# Altium schematic sheet SCH_WINGLET_IO.SchDoc: Winglet Board I/O
size B; DrawnBy: HCAdam; Organization: Aerospace Village; DocumentNumber: WINGLET; Revision: A; SheetNumber: 9; SheetTotal: 10
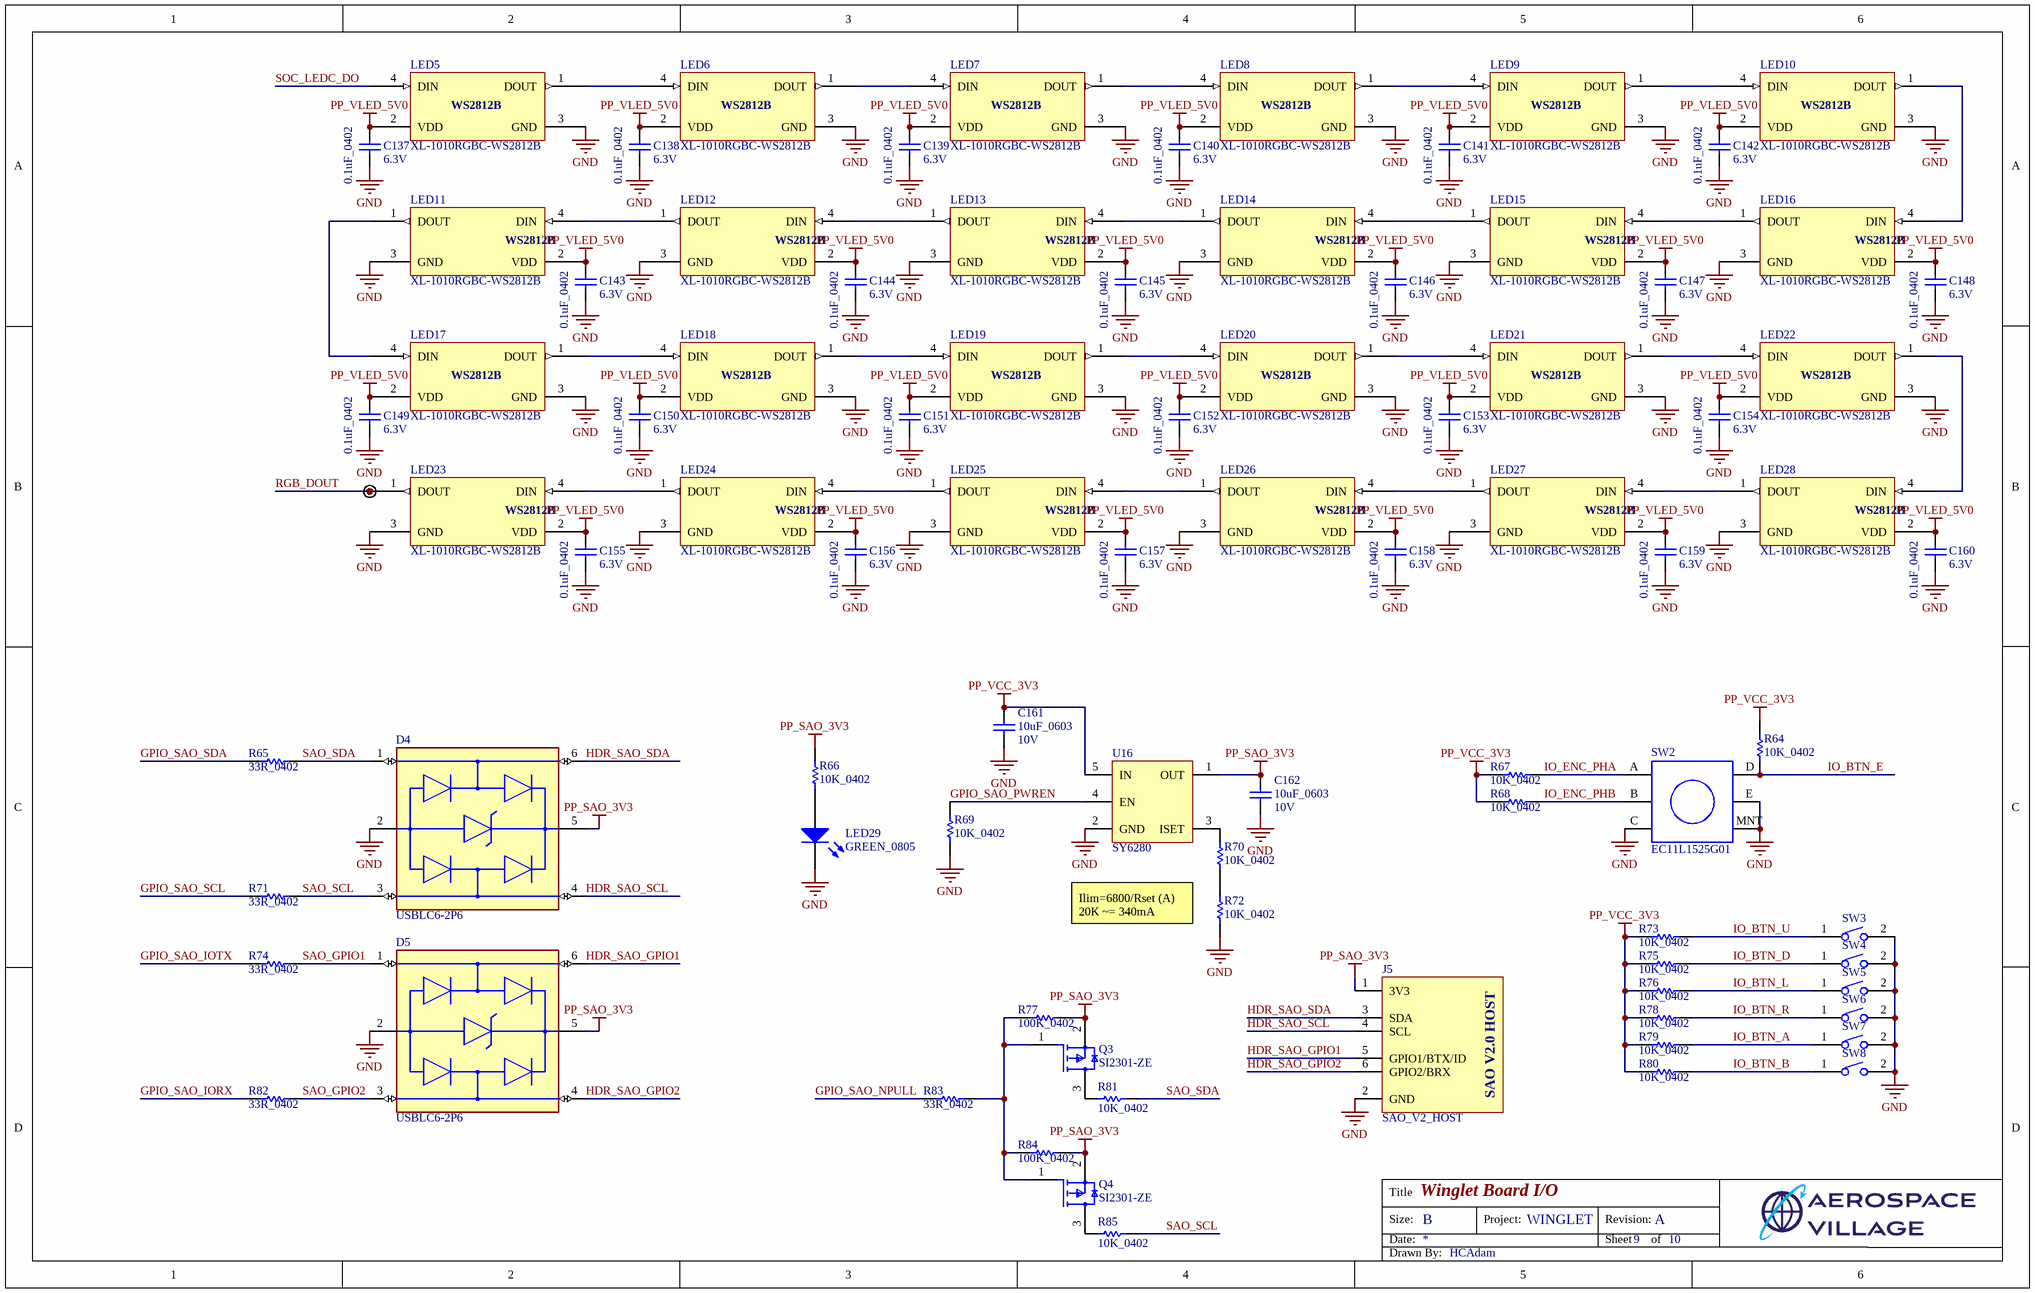
[diagram p0: SCH_WINGLET_IO.SchDoc]

## Parts
C137  0.1uF_0402  Voltage Rating: 6.3V  [CAPC1005X56X25NL10T15]
C138  0.1uF_0402  Voltage Rating: 6.3V  [CAPC1005X56X25NL10T15]
C139  0.1uF_0402  Voltage Rating: 6.3V  [CAPC1005X56X25NL10T15]
C140  0.1uF_0402  Voltage Rating: 6.3V  [CAPC1005X56X25NL10T15]
C141  0.1uF_0402  Voltage Rating: 6.3V  [CAPC1005X56X25NL10T15]
C142  0.1uF_0402  Voltage Rating: 6.3V  [CAPC1005X56X25NL10T15]
C143  0.1uF_0402  Voltage Rating: 6.3V  [CAPC1005X56X25NL10T15]
C144  0.1uF_0402  Voltage Rating: 6.3V  [CAPC1005X56X25NL10T15]
C145  0.1uF_0402  Voltage Rating: 6.3V  [CAPC1005X56X25NL10T15]
C146  0.1uF_0402  Voltage Rating: 6.3V  [CAPC1005X56X25NL10T15]
C147  0.1uF_0402  Voltage Rating: 6.3V  [CAPC1005X56X25NL10T15]
C148  0.1uF_0402  Voltage Rating: 6.3V  [CAPC1005X56X25NL10T15]
C149  0.1uF_0402  Voltage Rating: 6.3V  [CAPC1005X56X25NL10T15]
C150  0.1uF_0402  Voltage Rating: 6.3V  [CAPC1005X56X25NL10T15]
C151  0.1uF_0402  Voltage Rating: 6.3V  [CAPC1005X56X25NL10T15]
C152  0.1uF_0402  Voltage Rating: 6.3V  [CAPC1005X56X25NL10T15]
C153  0.1uF_0402  Voltage Rating: 6.3V  [CAPC1005X56X25NL10T15]
C154  0.1uF_0402  Voltage Rating: 6.3V  [CAPC1005X56X25NL10T15]
C155  0.1uF_0402  Voltage Rating: 6.3V  [CAPC1005X56X25NL10T15]
C156  0.1uF_0402  Voltage Rating: 6.3V  [CAPC1005X56X25NL10T15]
C157  0.1uF_0402  Voltage Rating: 6.3V  [CAPC1005X56X25NL10T15]
C158  0.1uF_0402  Voltage Rating: 6.3V  [CAPC1005X56X25NL10T15]
C159  0.1uF_0402  Voltage Rating: 6.3V  [CAPC1005X56X25NL10T15]
C160  0.1uF_0402  Voltage Rating: 6.3V  [CAPC1005X56X25NL10T15]
C161  10uF_0603  Voltage Rating: 10V  [CAPC1609X100X15NL20]
C162  10uF_0603  Voltage Rating: 10V  [CAPC1609X100X15NL20]
D4  USBLC6-2P6  [FP-SOT-666-MFG]
D5  USBLC6-2P6  [FP-SOT-666-MFG]
J5  SAO_V2_HOST  [SAO_FEMALE]
LED5  XL-1010RGBC-WS2812B  [DFN3127P600-8N]
LED6  XL-1010RGBC-WS2812B  [DFN3127P600-8N]
LED7  XL-1010RGBC-WS2812B  [DFN3127P600-8N]
LED8  XL-1010RGBC-WS2812B  [DFN3127P600-8N]
LED9  XL-1010RGBC-WS2812B  [DFN3127P600-8N]
LED10  XL-1010RGBC-WS2812B  [DFN3127P600-8N]
LED11  XL-1010RGBC-WS2812B  [DFN3127P600-8N]
LED12  XL-1010RGBC-WS2812B  [DFN3127P600-8N]
LED13  XL-1010RGBC-WS2812B  [DFN3127P600-8N]
LED14  XL-1010RGBC-WS2812B  [DFN3127P600-8N]
LED15  XL-1010RGBC-WS2812B  [DFN3127P600-8N]
LED16  XL-1010RGBC-WS2812B  [DFN3127P600-8N]
LED17  XL-1010RGBC-WS2812B  [DFN3127P600-8N]
LED18  XL-1010RGBC-WS2812B  [DFN3127P600-8N]
LED19  XL-1010RGBC-WS2812B  [DFN3127P600-8N]
LED20  XL-1010RGBC-WS2812B  [DFN3127P600-8N]
LED21  XL-1010RGBC-WS2812B  [DFN3127P600-8N]
LED22  XL-1010RGBC-WS2812B  [DFN3127P600-8N]
LED23  XL-1010RGBC-WS2812B  [DFN3127P600-8N]
LED24  XL-1010RGBC-WS2812B  [DFN3127P600-8N]
LED25  XL-1010RGBC-WS2812B  [DFN3127P600-8N]
LED26  XL-1010RGBC-WS2812B  [DFN3127P600-8N]
LED27  XL-1010RGBC-WS2812B  [DFN3127P600-8N]
LED28  XL-1010RGBC-WS2812B  [DFN3127P600-8N]
LED29  GREEN_0805  [0805_A]
Q3  SI2301-ZE  [FP-SOT23-MFG]
Q4  SI2301-ZE  [FP-SOT23-MFG]
R64  10K_0402  [RESC1005X40X25NL05T05]
R65  33R_0402  [RESC1005X40X25NL05T05]
R66  10K_0402  [RESC1005X40X25NL05T05]
R67  10K_0402  [RESC1005X40X25NL05T05]
R68  10K_0402  [RESC1005X40X25NL05T05]
R69  10K_0402  [RESC1005X40X25NL05T05]
R70  10K_0402  [RESC1005X40X25NL05T05]
R71  33R_0402  [RESC1005X40X25NL05T05]
R72  10K_0402  [RESC1005X40X25NL05T05]
R73  10K_0402  [RESC1005X40X25NL05T05]
R74  33R_0402  [RESC1005X40X25NL05T05]
R75  10K_0402  [RESC1005X40X25NL05T05]
R76  10K_0402  [RESC1005X40X25NL05T05]
R77  100K_0402  [RESC1005X40X25NL05T10]
R78  10K_0402  [RESC1005X40X25NL05T05]
R79  10K_0402  [RESC1005X40X25NL05T05]
R80  10K_0402  [RESC1005X40X25NL05T05]
R81  10K_0402  [RESC1005X40X25NL05T05]
R82  33R_0402  [RESC1005X40X25NL05T05]
R83  33R_0402  [RESC1005X40X25NL05T05]
R84  100K_0402  [RESC1005X40X25NL05T10]
R85  10K_0402  [RESC1005X40X25NL05T05]
SW2  EC11L1525G01  [LCSC_ALPS_EC11L1525G01]
SW3  C5127964  [LCSC_SMD_SW_MED]  (value not drawn)
SW4  C5127964  [LCSC_SMD_SW_MED]  (value not drawn)
SW5  C5127964  [LCSC_SMD_SW_MED]  (value not drawn)
SW6  C5127964  [LCSC_SMD_SW_MED]  (value not drawn)
SW7  C5127964  [LCSC_SMD_SW_MED]  (value not drawn)
SW8  C5127964  [LCSC_SMD_SW_MED]  (value not drawn)
TP28  TESTPOINT  [TESTPOINT-0.7MM-SINGLE-LAYER]  (value not drawn)  (no BOM)
U16  SY6280  [SOT95P292X115-5N]

## Nets
GND: C137.1 C138.1 C139.1 C140.1 C141.1 C142.1 C143.1 C144.1 C145.1 C146.1 C147.1 C148.1 C149.1 C150.1 C151.1 C152.1 C153.1 C154.1 C155.1 C156.1 C157.1 C158.1 C159.1 C160.1 C161.1 C162.1 D4.2(GND) D5.2(GND) J5.2(GND) LED5.3(GND) LED6.3(GND) LED7.3(GND) LED8.3(GND) LED9.3(GND) LED10.3(GND) LED11.3(GND) LED12.3(GND) LED13.3(GND) LED14.3(GND) LED15.3(GND) LED16.3(GND) LED17.3(GND) LED18.3(GND) LED19.3(GND) LED20.3(GND) LED21.3(GND) LED22.3(GND) LED23.3(GND) LED24.3(GND) LED25.3(GND) LED26.3(GND) LED27.3(GND) LED28.3(GND) LED29.1(K) R69.2 R72.2 SW2.C SW2.E SW2.MNT SW3.2 SW4.2 SW5.2 SW6.2 SW7.2 SW8.2 U16.2(GND)
PP_SAO_3V3: C162.2 D4.5(VBUS) D5.5(VBUS) J5.1(3V3) Q3.2(S) Q4.2(S) R66.2 R77.2 R84.2 U16.1(OUT)
PP_VCC_3V3: C161.2 R64.2 R67.2 R68.1 R73.2 R75.2 R76.2 R78.2 R79.2 R80.2 U16.5(IN)
PP_VLED_5V0: C137.2 C138.2 C139.2 C140.2 C141.2 C142.2 C143.2 C144.2 C145.2 C146.2 C147.2 C148.2 C149.2 C150.2 C151.2 C152.2 C153.2 C154.2 C155.2 C156.2 C157.2 C158.2 C159.2 C160.2 LED5.2(VDD) LED6.2(VDD) LED7.2(VDD) LED8.2(VDD) LED9.2(VDD) LED10.2(VDD) LED11.2(VDD) LED12.2(VDD) LED13.2(VDD) LED14.2(VDD) LED15.2(VDD) LED16.2(VDD) LED17.2(VDD) LED18.2(VDD) LED19.2(VDD) LED20.2(VDD) LED21.2(VDD) LED22.2(VDD) LED23.2(VDD) LED24.2(VDD) LED25.2(VDD) LED26.2(VDD) LED27.2(VDD) LED28.2(VDD)
GPIO_SAO_IORX: R82.1
GPIO_SAO_IOTX: R74.1
GPIO_SAO_NPULL: R83.1
GPIO_SAO_PWREN: R69.1 U16.4(EN)
GPIO_SAO_SCL: R71.1
GPIO_SAO_SDA: R65.1
HDR_SAO_GPIO1: D5.6(I/O1) J5.5(GPIO1/BTX/ID)
HDR_SAO_GPIO2: D5.4(I/O2) J5.6(GPIO2/BRX)
HDR_SAO_SCL: D4.4(I/O2) J5.4(SCL)
HDR_SAO_SDA: D4.6(I/O1) J5.3(SDA)
IO_BTN_A: R79.1 SW7.1
IO_BTN_B: R80.1 SW8.1
IO_BTN_D: R75.1 SW4.1
IO_BTN_E: R64.1 SW2.D
IO_BTN_L: R76.1 SW5.1
IO_BTN_R: R78.1 SW6.1
IO_BTN_U: R73.1 SW3.1
IO_ENC_PHA: R67.1 SW2.A
IO_ENC_PHB: R68.2 SW2.B
RGB_DOUT: LED23.1(DOUT) TP28.1
SAO_GPIO1: D5.1(I/O1) R74.2
SAO_GPIO2: D5.3(I/O2) R82.2
SAO_SCL: D4.3(I/O2) R71.2 R85.1
SAO_SDA: D4.1(I/O1) R65.2 R81.1
SOC_LEDC_DO: LED5.4(DIN)
NetLED5_1: LED5.1(DOUT) LED6.4(DIN)
NetLED6_1: LED6.1(DOUT) LED7.4(DIN)
NetLED7_1: LED7.1(DOUT) LED8.4(DIN)
NetLED8_1: LED8.1(DOUT) LED9.4(DIN)
NetLED9_1: LED9.1(DOUT) LED10.4(DIN)
NetLED10_1: LED10.1(DOUT) LED16.4(DIN)
NetLED11_1: LED11.1(DOUT) LED17.4(DIN)
NetLED11_4: LED11.4(DIN) LED12.1(DOUT)
NetLED12_4: LED12.4(DIN) LED13.1(DOUT)
NetLED13_4: LED13.4(DIN) LED14.1(DOUT)
NetLED14_4: LED14.4(DIN) LED15.1(DOUT)
NetLED15_4: LED15.4(DIN) LED16.1(DOUT)
NetLED17_1: LED17.1(DOUT) LED18.4(DIN)
NetLED18_1: LED18.1(DOUT) LED19.4(DIN)
NetLED19_1: LED19.1(DOUT) LED20.4(DIN)
NetLED20_1: LED20.1(DOUT) LED21.4(DIN)
NetLED21_1: LED21.1(DOUT) LED22.4(DIN)
NetLED22_1: LED22.1(DOUT) LED28.4(DIN)
NetLED23_4: LED23.4(DIN) LED24.1(DOUT)
NetLED24_4: LED24.4(DIN) LED25.1(DOUT)
NetLED25_4: LED25.4(DIN) LED26.1(DOUT)
NetLED26_4: LED26.4(DIN) LED27.1(DOUT)
NetLED27_4: LED27.4(DIN) LED28.1(DOUT)
NetLED29_2: LED29.2(A) R66.1
NetQ3_1: Q3.1(G) Q4.1(G) R77.1 R83.2 R84.1
NetQ3_3: Q3.3(D) R81.2
NetQ4_3: Q4.3(D) R85.2
NetR70_1: R70.1 U16.3(ISET)
NetR70_2: R70.2 R72.1

## Notes on the sheet
- Ilim=6800/Rset (A)
  20K ~= 340mA
- Title
- Size:
- Date:
- B
- Project:
- Revision:
- Sheet
- of
- Drawn By:
- (in symbol SAO_V2_HOST) SAO V2.0 HOST
- (in symbol XL-1010RGBC-WS2812B) WS2812B

## Library data of the parts
C137-C160 = CMP-2008-02743-1: 04026D104KAT2A; Manufacturer: AVX Interconnect / Elco; Part Number: 04026D104KAT2A
C161 C162 = CMP-2006-00191-1: Part Number: TACL106M006XTA; Manufacturer: AVX Interconnect / Elco
D4 D5 = CMP-12225-000058-1: TVS DIODE 5.25V 17V SOT666; Min Breakdown Voltage: 6V; Power Line Protection: Yes; Element Configuration: Dual; Test Current: 1mA; Working Voltage: 5V; Number of Channels: 2; Max Reverse Leakage Current: 150nA; Direction: Unidirectional; Peak Pulse Current: 5A; Number of Elements: 1; Capacitance: 3.5pF; Max Breakdown Voltage: 6V; Height: 0.6mm; Depth: 1.3mm; Contact Plating: Tin; Reverse Breakdown Voltage: 6V; REACH SVHC: No SVHC; Operating Supply Voltage: 5V; Width: 1.3mm; Max Operating Temperature: 125°C; Reverse Standoff Voltage: 5V; ESD Protection: Yes; Package Quantity: 1; Termination: SMD/SMT; Length: 1.7mm; Leakage Current: 150nA; Number of Bidirectional Channels: 2; Case/Package: SOT-666; Min Operating Temperature: -40°C; Number of Pins: 6; Clamping Voltage: 17V; Breakdown Voltage: 6V; Lead Free: Lead Free; Radiation Hardening: No; Packaging: Tape and Reel; Mount: Surface Mount; Polarity: Unidirectional
J5 = SAO_V2_HOST: SAO V2 Host (Female) Side
LED5-LED28 = XL-1010RGBC-WS2812B: 1010 RGB WS2812B LED 3.5-5.5V
LED29 = CMP-1426-00007-1: SMD mono-color Chip LED, WL-SMCW, Green / 150080GS75000; Manufacturer: Wuerth Elektronik; PackageReference: 0805_A; Color: Green; PartNumber: 150080GS75000; ComponentLink2URL: http://katalog.we-online.com/led/datasheet/150080GS75000.pdf; ComponentLink1URL: http://www.we-online.com; ComponentLink1Description: Manufacturer URL; ComponentLink2Description: Datasheet
Q3 Q4 = CMP-12801-000062-2: MOSFET P-CH 30V SOT23; Gate to Source Voltage (Vgs): 20V; Turn-Off Delay Time: 31ns; Drain to Source Voltage (Vdss): -30V; Fall Time: 15ns; Threshold Voltage: -2.1V; Rise Time: 5ns; Input Capacitance: 563pF; Number of Channels: 1; Drain to Source Resistance: 65mR; Element Configuration: Single; Max Power Dissipation: 1.08W; Turn-On Delay Time: 4.8ns; Continuous Drain Current (ID): 3.8A; Lead Free: Lead Free; Number of Pins: 3; Package Quantity: 3000; Width: 1.4mm; Radiation Hardening: No; Mount: Surface Mount; Case/Package: SOT-23; Contact Plating: Tin; Rds On Max: 65mR; Height: 1.1mm; REACH SVHC: No SVHC; Weight: 0.000282oz; Max Operating Temperature: 150°C; Packaging: Tape and Reel; Min Operating Temperature: -55°C; Length: 3mm
R64 R66-R70 R72 R73 R75 R76 R78-R81 R85 = CMP-2000-07588-1: Chip Resistor, 10 KOhm, +/- 1%, 0.1 W, -55 to 155 degC, 0402 (1005 Metric), RoHS, Tape and Reel / ERJ2RKF1002X; Manufacturer: Panasonic; Power Rating: 100mW; Voltage Rating: 50V; Resistance: 10KOhm; Case\/Package: 0402; Temperature Coefficient: 100ppm\/degreesC; RoHSCompliant: True; Lead Free: LeadFree; Package Quantity: 1; Contact Plating: Tin; Length: 1mm; Radiation Hardening: No; REACH SVHC: NoSVHC; Max Operating Temperature: 155degC; Depth: 0.5mm; Case Code (Imperial): 0402; Military Standard: Not; Package Description: 2-Pin Surface Mount Device, Body 1 x 0.5 mm; Termination: SMD/SMT; Case Code (Metric): 1005; Height: 0.35mm; Packaging: TapeandReel; Voltage Rating (DC): 50V; Package Reference: 402; Number of Pins: 2; Tolerance: 1%; Mounting Technology: SurfaceMount; Width: 0.02inch; Mount: SurfaceMount; Datasheet URL: https://industrial.panasonic.com/cdbs/www-data/pdf/RDA0000/AOA0000C304.pdf; Composition: ThickFilm; Datasheet Version: 02/2017; Manufacturer URL: http://www.panasonic.com/; Max Power Dissipation: 100mW; Number of Terminations: 2; Min Operating Temperature: -55degC
R65 R71 R74 R82 R83 = CMP-2002-01146-1: ERJ2RKF33R0X; Manufacturer: Panasonic; Part Number: ERJ2RKF33R0X
R77 R84 = CMP-2002-07343-1: RC0402FR-07100KL; Manufacturer: Yageo / Phycomp; Part Number: RC0402FR-07100KL
SW2 = EC11L1525G01: EC11L1525G01 Rotary Encoder with Pushbutton
SW3-SW8 = SMD_SW_MED: SMD SPST Tactile Switch / C5127964
TP28 = TP_07: TESTPOINT SINGLE LAYER 0.7MM; AEC-Q: Yes; PPAP: Unknown; Selective Soldering: No; Value: Unknown; RoHS: Yes; Package: BOARD_FEATURE; Washable: Yes; Mounting: Unknown
U16 = SY6280: Low Loss Power Distribution Switch